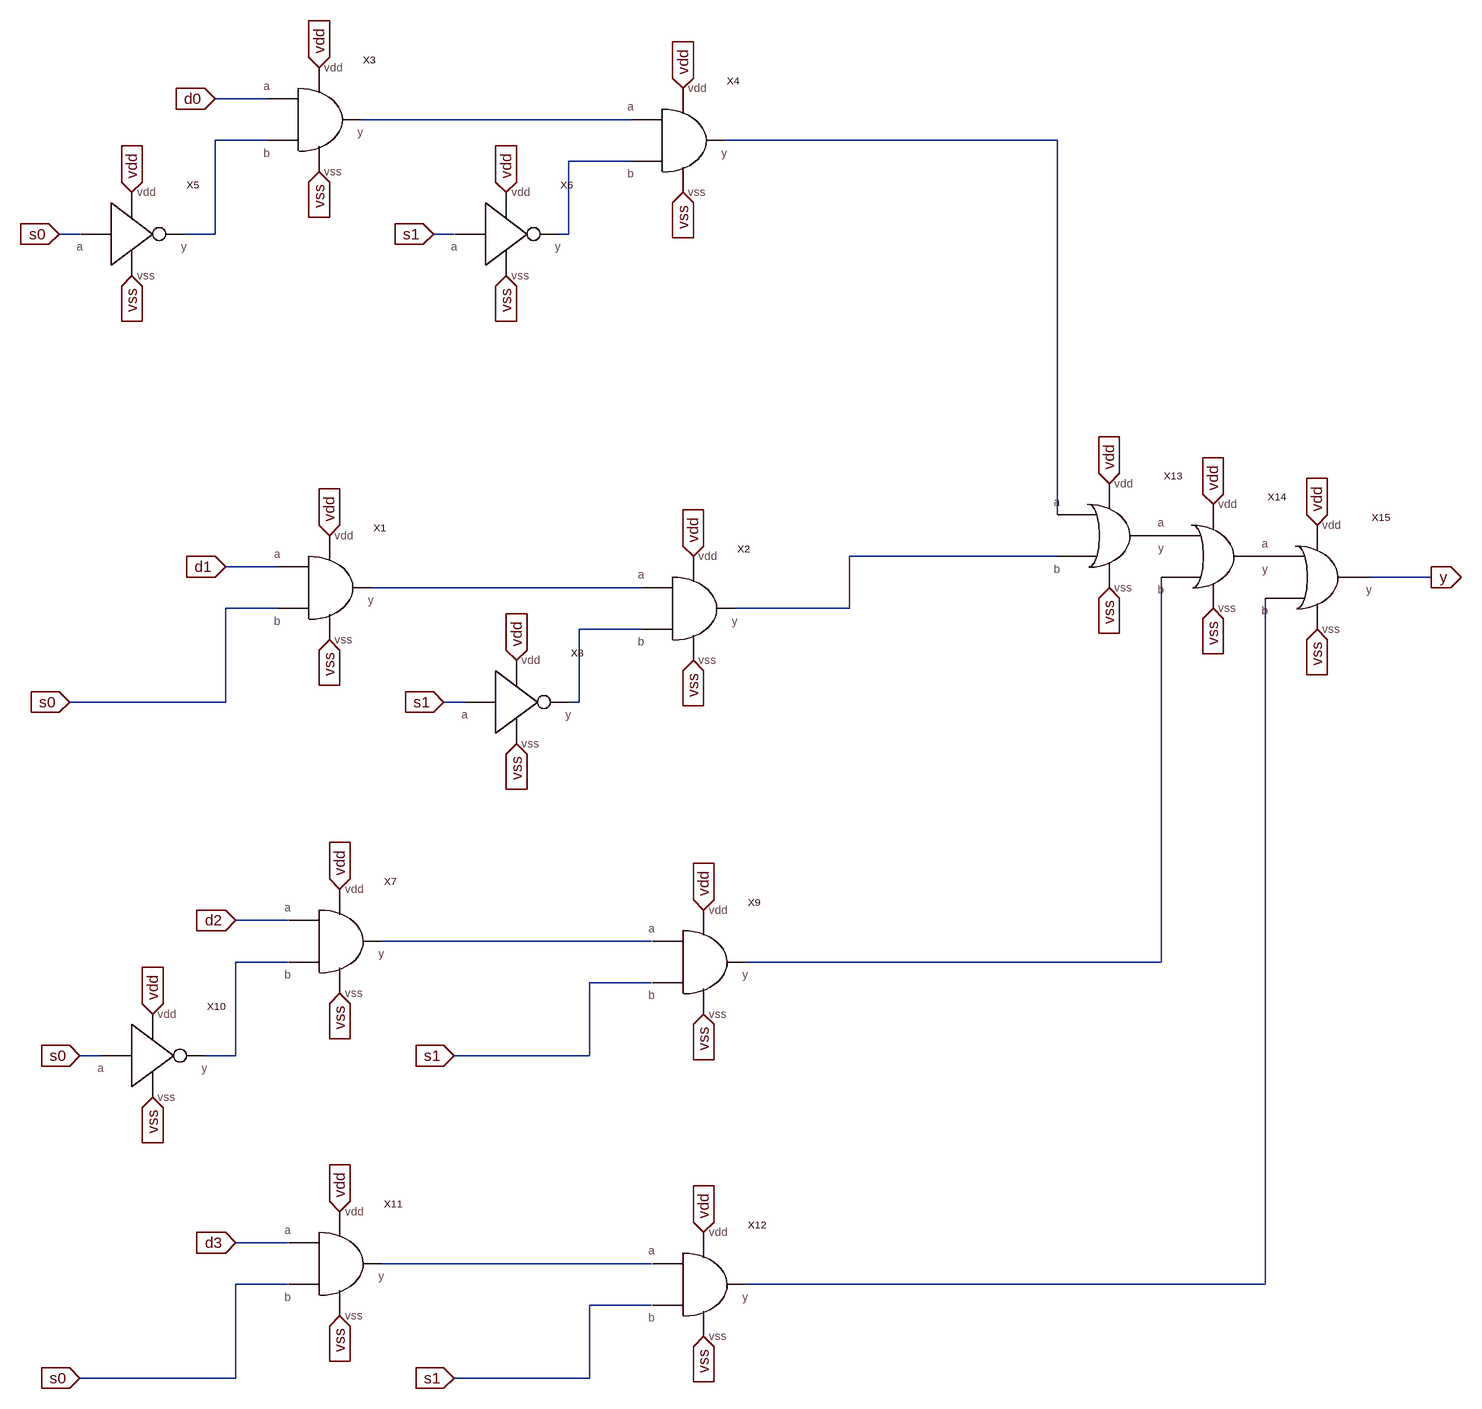
[diagram p0: schematic 4_1_mux.asc]
4_1_mux.asc, the LTspice schematic file:
Version 4
SHEET 1 1208 736
WIRE -800 -1616 -880 -1616
WIRE -240 -1584 -656 -1584
WIRE -800 -1552 -880 -1552
WIRE 416 -1552 -96 -1552
WIRE -240 -1520 -336 -1520
WIRE -1088 -1408 -1120 -1408
WIRE -880 -1408 -880 -1552
WIRE -880 -1408 -928 -1408
WIRE -512 -1408 -544 -1408
WIRE -336 -1408 -336 -1520
WIRE -336 -1408 -352 -1408
WIRE 416 -976 416 -1552
WIRE 416 -912 96 -912
WIRE -784 -896 -864 -896
WIRE 992 -880 896 -880
WIRE -224 -864 -640 -864
WIRE -784 -832 -864 -832
WIRE 96 -832 96 -912
WIRE 96 -832 -80 -832
WIRE -224 -800 -320 -800
WIRE -864 -688 -864 -832
WIRE -864 -688 -1104 -688
WIRE -496 -688 -528 -688
WIRE -320 -688 -320 -800
WIRE -320 -688 -336 -688
WIRE -768 -352 -848 -352
WIRE -208 -320 -624 -320
WIRE -768 -288 -848 -288
WIRE 576 -288 576 -880
WIRE 576 -288 -64 -288
WIRE -208 -256 -304 -256
WIRE -1056 -144 -1088 -144
WIRE -848 -144 -848 -288
WIRE -848 -144 -896 -144
WIRE -304 -144 -304 -256
WIRE -304 -144 -512 -144
WIRE -768 144 -848 144
WIRE -208 176 -624 176
WIRE -768 208 -848 208
WIRE 736 208 736 -848
WIRE 736 208 -64 208
WIRE -208 240 -304 240
WIRE -848 352 -848 208
WIRE -848 352 -1088 352
WIRE -304 352 -304 240
WIRE -304 352 -512 352
FLAG 992 -880 y
IOPIN 992 -880 Out
FLAG -880 -1616 d0
IOPIN -880 -1616 In
FLAG -1120 -1408 s0
IOPIN -1120 -1408 In
FLAG -720 -1664 vdd
IOPIN -720 -1664 In
FLAG -720 -1504 vss
IOPIN -720 -1504 In
FLAG -544 -1408 s1
IOPIN -544 -1408 In
FLAG -160 -1632 vdd
IOPIN -160 -1632 In
FLAG -160 -1472 vss
IOPIN -160 -1472 In
FLAG -1008 -1472 vdd
IOPIN -1008 -1472 In
FLAG -1008 -1344 vss
IOPIN -1008 -1344 In
FLAG -432 -1472 vdd
IOPIN -432 -1472 In
FLAG -432 -1344 vss
IOPIN -432 -1344 In
FLAG -864 -896 d1
IOPIN -864 -896 In
FLAG -1104 -688 s0
IOPIN -1104 -688 In
FLAG -704 -944 vdd
IOPIN -704 -944 In
FLAG -704 -784 vss
IOPIN -704 -784 In
FLAG -528 -688 s1
IOPIN -528 -688 In
FLAG -144 -912 vdd
IOPIN -144 -912 In
FLAG -144 -752 vss
IOPIN -144 -752 In
FLAG -416 -752 vdd
IOPIN -416 -752 In
FLAG -416 -624 vss
IOPIN -416 -624 In
FLAG -848 -352 d2
IOPIN -848 -352 In
FLAG -1088 -144 s0
IOPIN -1088 -144 In
FLAG -688 -400 vdd
IOPIN -688 -400 In
FLAG -688 -240 vss
IOPIN -688 -240 In
FLAG -512 -144 s1
IOPIN -512 -144 In
FLAG -128 -368 vdd
IOPIN -128 -368 In
FLAG -128 -208 vss
IOPIN -128 -208 In
FLAG -976 -208 vdd
IOPIN -976 -208 In
FLAG -976 -80 vss
IOPIN -976 -80 In
FLAG -848 144 d3
IOPIN -848 144 In
FLAG -1088 352 s0
IOPIN -1088 352 In
FLAG -688 96 vdd
IOPIN -688 96 In
FLAG -688 256 vss
IOPIN -688 256 In
FLAG -512 352 s1
IOPIN -512 352 In
FLAG -128 128 vdd
IOPIN -128 128 In
FLAG -128 288 vss
IOPIN -128 288 In
FLAG 496 -1024 vdd
IOPIN 496 -1024 In
FLAG 656 -992 vdd
IOPIN 656 -992 In
FLAG 816 -960 vdd
IOPIN 816 -960 In
FLAG 496 -864 vss
IOPIN 496 -864 In
FLAG 656 -832 vss
IOPIN 656 -832 In
FLAG 816 -800 vss
IOPIN 816 -800 In
SYMBOL and -720 -1584 R0
SYMATTR InstName X3
SYMBOL and -160 -1552 R0
SYMATTR InstName X4
SYMBOL not -1008 -1408 R0
SYMATTR InstName X5
SYMBOL not -432 -1408 R0
SYMATTR InstName X6
SYMBOL and -704 -864 R0
SYMATTR InstName X1
SYMBOL and -144 -832 R0
SYMATTR InstName X2
SYMBOL not -416 -688 R0
SYMATTR InstName X8
SYMBOL and -688 -320 R0
SYMATTR InstName X7
SYMBOL and -128 -288 R0
SYMATTR InstName X9
SYMBOL not -976 -144 R0
SYMATTR InstName X10
SYMBOL and -688 176 R0
SYMATTR InstName X11
SYMBOL and -128 208 R0
SYMATTR InstName X12
SYMBOL or 496 -944 R0
SYMATTR InstName X13
SYMBOL or 656 -912 R0
SYMATTR InstName X14
SYMBOL or 816 -880 R0
SYMATTR InstName X15

The netlist it stands for:
* 4_1_mux.asc
XX3 d0 N002 N001 vdd vss and  ; pins a b y vdd vss
XX4 N001 N004 N003 vdd vss and  ; pins a b y vdd vss
XX5 s0 N002 vdd vss not  ; pins a y vdd vss
XX6 s1 N004 vdd vss not  ; pins a y vdd vss
XX1 d1 s0 N006 vdd vss and  ; pins a b y vdd vss
XX2 N006 N007 N005 vdd vss and  ; pins a b y vdd vss
XX8 s1 N007 vdd vss not  ; pins a y vdd vss
XX7 d2 N009 N008 vdd vss and  ; pins a b y vdd vss
XX9 N008 s1 N010 vdd vss and  ; pins a b y vdd vss
XX10 s0 N009 vdd vss not  ; pins a y vdd vss
XX11 d3 s0 N011 vdd vss and  ; pins a b y vdd vss
XX12 N011 s1 N012 vdd vss and  ; pins a b y vdd vss
XX13 N003 N005 P001 vdd vss or  ; pins a b y vdd vss
XX14 P001 N010 P002 vdd vss or  ; pins a b y vdd vss
XX15 P002 N012 y vdd vss or  ; pins a b y vdd vss
.backanno
.end